# EAGLE schematic Target_board (EAGLE 6.4)
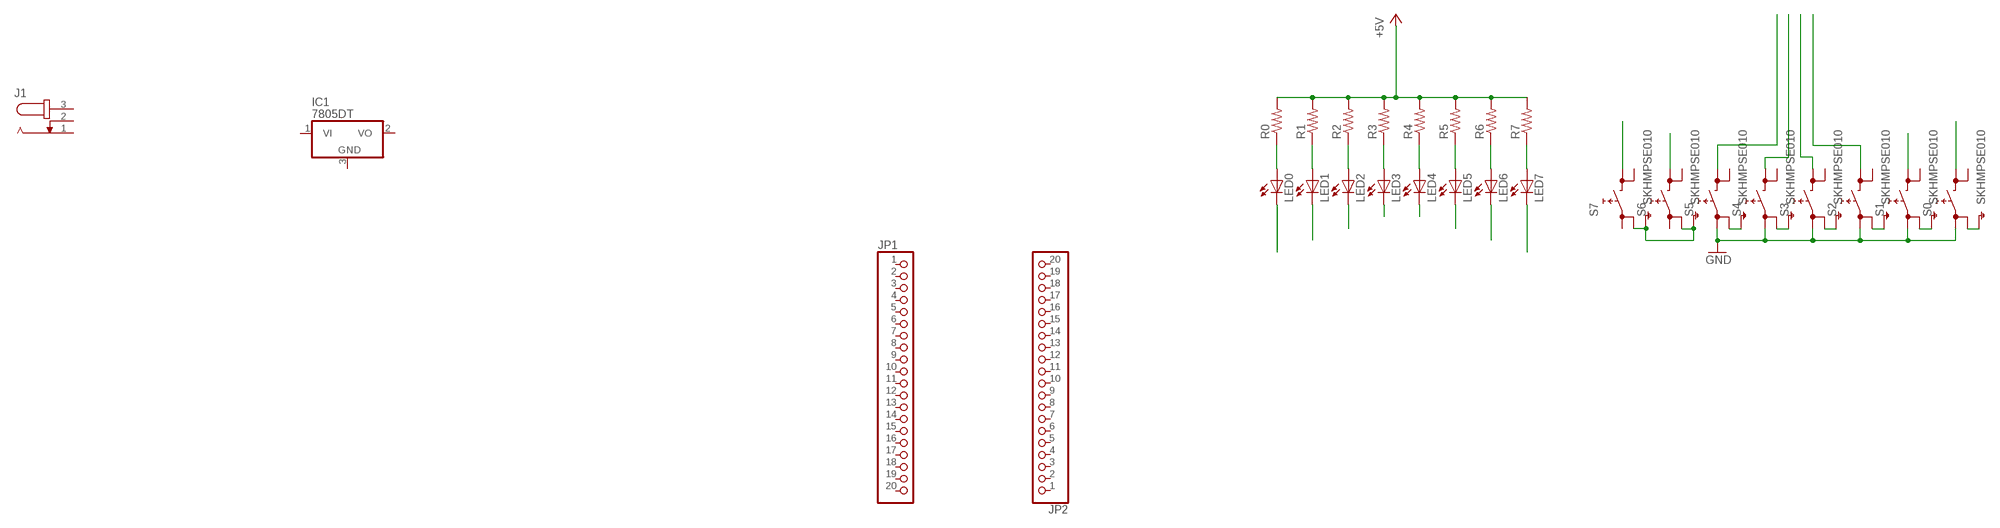
[diagram p0: schematic, sheet 1]

## Parts
IC1  7805DT  [TO252]
J1  JACK-PLUG0  [SPC4077]
JP1  PINHD-1X20  [1X20]
JP2  PINHD-1X20  [1X20]
LED0  LEDCHIP-LED0805  [CHIP-LED0805]
LED1  LEDCHIP-LED0805  [CHIP-LED0805]
LED2  LEDCHIP-LED0805  [CHIP-LED0805]
LED3  LEDCHIP-LED0805  [CHIP-LED0805]
LED4  LEDCHIP-LED0805  [CHIP-LED0805]
LED5  LEDCHIP-LED0805  [CHIP-LED0805]
LED6  LEDCHIP-LED0805  [CHIP-LED0805]
LED7  LEDCHIP-LED0805  [CHIP-LED0805]
R0  R-US_R0805  [R0805]
R1  R-US_R0805  [R0805]
R2  R-US_R0805  [R0805]
R3  R-US_R0805  [R0805]
R4  R-US_R0805  [R0805]
R5  R-US_R0805  [R0805]
R6  R-US_R0805  [R0805]
R7  R-US_R0805  [R0805]
S0  SKHMPSE010  [SKHMPXE010]
S1  SKHMPSE010  [SKHMPXE010]
S2  SKHMPSE010  [SKHMPXE010]
S3  SKHMPSE010  [SKHMPXE010]
S4  SKHMPSE010  [SKHMPXE010]
S5  SKHMPSE010  [SKHMPXE010]
S6  SKHMPSE010  [SKHMPXE010]
S7  SKHMPSE010  [SKHMPXE010]

## Nets
+5V: R0.2 R1.2 R2.2 R3.2 R4.2 R5.2 R6.2 R7.2
GND: S0.1(1.1) S1.1(1.1) S2.1(1.1) S3.1(1.1) S4.1(1.1) S5.1(1.1)
N$1: S4.3(2.1)
N$2: S3.3(2.1)
N$3: LED0.A R0.1
N$4: LED1.A R1.1
N$5: LED2.A R2.1
N$6: LED3.A R3.1
N$7: LED4.A R4.1
N$8: LED5.A R5.1
N$9: LED6.A R6.1
N$10: LED7.A R7.1
N$11: LED2.C
N$12: LED3.C
N$13: LED4.C
N$14: LED1.C
N$15: LED0.C
N$16: LED5.C
N$17: LED6.C
N$18: LED7.C
N$19: S5.3(2.1)
N$20: S6.3(2.1)
N$21: S7.3(2.1)
N$22: S2.3(2.1)
N$23: S1.3(2.1)
N$24: S0.3(2.1)
N$25: S6.2(1.2) S6.5(SH) S7.2(1.2) S7.5(SH)
N$27: S5.2(1.2) S5.5(SH)
N$28: S1.2(1.2) S1.5(SH)
N$29: S3.2(1.2) S3.5(SH)
N$30: S2.2(1.2) S2.5(SH)
N$31: S0.2(1.2) S0.5(SH)
N$32: S4.2(1.2) S4.5(SH)
Unconnected: IC1.1(VI) IC1.2(VO) IC1.3(GND) J1.1 J1.2 J1.3 JP1.1 JP1.2 JP1.3 JP1.4 JP1.5 JP1.6 JP1.7 JP1.8 JP1.9 JP1.10 JP1.11 JP1.12 JP1.13 JP1.14 JP1.15 JP1.16 JP1.17 JP1.18 JP1.19 JP1.20 JP2.1 JP2.2 JP2.3 JP2.4 JP2.5 JP2.6 JP2.7 JP2.8 JP2.9 JP2.10 JP2.11 JP2.12 JP2.13 JP2.14 JP2.15 JP2.16 JP2.17 JP2.18 JP2.19 JP2.20 S0.4(2.2) S1.4(2.2) S2.4(2.2) S3.4(2.2) S4.4(2.2) S5.4(2.2) S6.1(1.1) S6.4(2.2) S7.1(1.1) S7.4(2.2)

## Library data of the parts
IC1 = linear:78*: Positive VOLTAGE REGULATOR Source: http://cache.national.com/ds/LM/LM78L05.pdf http://www.fairchildsemi.com/ds/LM/LM7805.pdf
J1 = con-jack:JACK-PLUG: DC POWER JACK Power Jack, DC, Right Angle, Through Hole, Rated 5A at 16VDC, PC Terminals Distributor: Farnell (www.Farnell.de) Drawing: 84N1161.pdf / 84N1162.pdf Manufacturer: SPC Technology (www.spctechnology.com) Type: SPC4077 / SPC 4078; OC_FARNELL: unknown; OC_NEWARK: unknown
JP1 JP2 = pinhead:PINHD-1X20: PIN HEADER
LED0 LED1-LED7 = led:LED: LED OSRAM: - CHIPLED LG R971, LG N971, LY N971, LG Q971, LY Q971, LO R971, LY R971 LH N974, LH R974 LS Q976, LO Q976, LY Q976 LO Q996 - Hyper CHIPLED LW Q18S LB Q993, LB Q99A, LB R99A - SideLED LS A670, LO A670, LY A670, LG A670, LP A670 LB A673, LV A673, LT A673, LW A673 LH A674 LY A675 LS A676, LA A676, LO A676, LY A676, LW A676 LS A679, LY A679, LG A679 - Hyper Micro SIDELED® LS Y876, LA Y876, LO Y876, LY Y876 LT Y87S - SmartLED LW L88C, LW L88S LB L89C, LB L89S, LG L890 LS L89K, LO L89K, LY L89K LS L896, LA L896, LO L896, LY L896 - TOPLED LS T670, LO T670, LY T670, LG T670, LP T670 LSG T670, LSP T670, LSY T670, LOP T670, LYG T670 LG T671, LOG T671, LSG T671 LB T673, LV T673, LT T673, LW T673 LH T674 LS T676, LA T676, LO T676, LY T676, LB T676, LH T676, LSB T676, LW T676 LB T67C, LV T67C, LT T67C, LS T67K, LO T67K, LY T67K, LW E67C LS E67B, LA E67B, LO E67B, LY E67B, LB E67C, LV E67C, LT E67C LW T67C LS T679, LY T679, LG T679 LS T770, LO T770, LY T770, LG T770, LP T770 LB T773, LV T773, LT T773, LW T773 LH T774 LS E675, LA E675, LY E675, LS T675 LS T776, LA T776, LO T776, LY T776, LB T776 LHGB T686 LT T68C, LB T68C - Hyper Mini TOPLED® LB M676 - Mini TOPLED Santana® LG M470 LS M47K, LO M47K, LY M47K Source: http://www.osram.convergy.de LUXEON: - LUMILED® LXK2-PW12-R00, LXK2-PW12-S00, LXK2-PW14-U00, LXK2-PW14-V00 LXK2-PM12-R00, LXK2-PM12-S00, LXK2-PM14-U00 LXK2-PE12-Q00, LXK2-PE12-R00, LXK2-PE12-S00, LXK2-PE14-T00, LXK2-PE14-U00 LXK2-PB12-K00, LXK2-PB12-L00, LXK2-PB12-M00, LXK2-PB14-N00, LXK2-PB14-P00, LXK2-PB14-Q00 LXK2-PR12-L00, LXK2-PR12-M00, LXK2-PR14-Q00, LXK2-PR14-R00 LXK2-PD12-Q00, LXK2-PD12-R00, LXK2-PD12-S00 LXK2-PH12-R00, LXK2-PH12-S00 LXK2-PL12-P00, LXK2-PL12-Q00, LXK2-PL12-R00 Source: www.luxeon.com KINGBRIGHT: KA-3528ASYC Source: www.kingbright.com
R0 R1-R7 = resistor:R-US_: RESISTOR, American symbol
S0 S1-S7 = switch:SKHMP*E010: 6.2 X 6.5mm TACT Switch (SMD) Source: http://www3.alps.co.jp/WebObjects/catalog.woa/PDF/E/Switch/Tact/SKHM/SKHM.PDF